# Altium schematic sheet FOC_Power.SchDoc
size A4; SheetNumber: 2; SheetTotal: 3
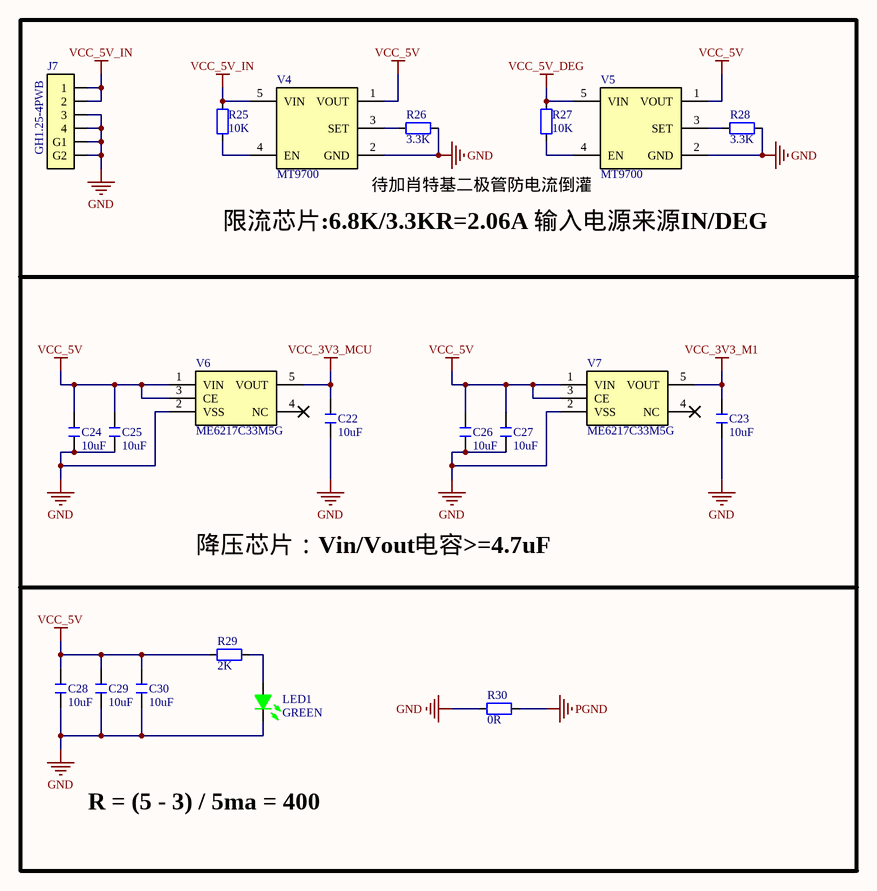
[diagram p0: FOC_Power.SchDoc]

## Parts
C22  10uF  [C 0603_L]
C23  10uF  [C 0603_L]
C24  10uF  [C 0603_L]
C25  10uF  [C 0603_L]
C26  10uF  [C 0603_L]
C27  10uF  [C 0603_L]
C28  10uF  [C 0603_L]
C29  10uF  [C 0603_L]
C30  10uF  [C 0603_L]
J7  GH1.25-4PWB  [GH1.25-4PWB]
LED1  GREEN  [LED_0603G]
R25  10K  [R 0603_L]
R26  3.3K  [R 0603_L]
R27  10K  [R 0603_L]
R28  3.3K  [R 0603_L]
R29  2K  [R 0603_L]
R30  0R  [R 0603_L]
V4  MT9700  [SOT-23-5]
V5  MT9700  [SOT-23-5]
V6  ME6217C33M5G  [SOT-23-5L]
V7  ME6217C33M5G  [SOT-23-5L]

## Nets
GND: C22.2 C23.2 C24.2 C25.2 C26.2 C27.2 C28.1 C29.2 C30.2 J7.3 J7.4 J7.G1 J7.G2 LED1.2(-) R26.1 R28.1 R30.1 V4.2(GND) V5.2(GND) V6.2(VSS) V7.2(VSS)
PGND: R30.2
VCC_3V3_M1: C23.1 V7.5(VOUT)
VCC_3V3_MCU: C22.1 V6.5(VOUT)
VCC_5V: C24.1 C25.1 C26.1 C27.1 C28.2 C29.1 C30.1 R29.1 V4.1(VOUT) V5.1(VOUT) V6.1(VIN) V6.3(CE) V7.1(VIN) V7.3(CE)
VCC_5V_DEG: R27.2 V5.5(VIN)
VCC_5V_IN: J7.1 J7.2 R25.2 V4.5(VIN)
NetLED1_1: LED1.1(+) R29.2
NetR25_1: R25.1 V4.4(EN)
NetR26_2: R26.2 V4.3(SET)
NetR27_1: R27.1 V5.4(EN)
NetR28_2: R28.2 V5.3(SET)

Not connected (* = marked no-connect by the designer): V6 4(NC)*; V7 4(NC)*

## Notes on the sheet
- (near V4) 待加肖特基二极管防电流倒灌
- 限流芯片:6.8K/3.3KR=2.06A 输入电源来源IN/DEG
- 降压芯片：Vin/Vout电容>=4.7uF
- R = (5 - 3) / 5ma = 400

## Library data of the parts
C22-C30 = C: 贴片电容; BOM名称: 无极性贴片电容
J7 = GH1.25-4PWB: GH1.25-4P 卧贴
LED1 = LED_G: 贴片LED 0603 绿色
R25-R30 = R: 贴片电阻; BOM名称: 贴片电阻
V4 V5 = MT9700: 功率电子开关